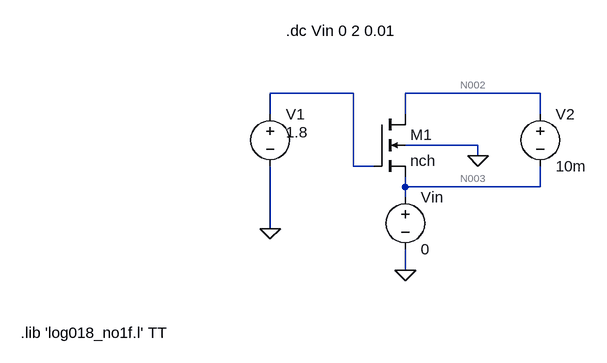
[diagram p0: schematic mosSW.asc]
mosSW.asc, the LTspice schematic file:
Version 4
SHEET 1 880 680
WIRE 96 32 -32 32
WIRE 384 32 176 32
WIRE -32 64 -32 32
WIRE 176 64 176 32
WIRE 384 64 384 32
WIRE 288 112 176 112
WIRE 288 128 288 112
WIRE 96 144 96 32
WIRE 128 144 96 144
WIRE 176 176 176 160
WIRE 384 176 384 144
WIRE 384 176 176 176
WIRE 176 192 176 176
WIRE -32 240 -32 144
WIRE 176 304 176 272
FLAG -32 240 0
FLAG 176 304 0
FLAG 288 128 0
SYMBOL voltage -32 48 R0
WINDOW 3 24 44 Left 2
WINDOW 123 0 0 Left 0
WINDOW 39 0 0 Left 0
SYMATTR Value 1.8
SYMATTR InstName V1
SYMBOL voltage 384 48 R0
SYMATTR InstName V2
SYMATTR Value 10m
SYMBOL voltage 176 176 R0
SYMATTR InstName Vin
SYMATTR Value 0
SYMBOL nmos4 128 64 R0
SYMATTR InstName M1
SYMATTR Value nch
SYMATTR Value2 l=180n w=1u m=1
TEXT -8 -64 Left 2 !.dc Vin 0 2 0.01
TEXT -416 400 Left 2 !.lib 'log018_no1f.l' TT

The netlist it stands for:
* mosSW.asc
V1 N001 0 1.8
V2 N002 N003 10m
Vin N003 0 0
M1 N002 N001 N003 0 nch l=180n w=1u m=1
.model NMOS NMOS
.model PMOS PMOS
.lib standard.mos
.dc Vin 0 2 0.01
.lib 'log018_no1f.l' TT
.backanno
.end

* Results of the author's LTspice run, read from the files saved beside the schematic
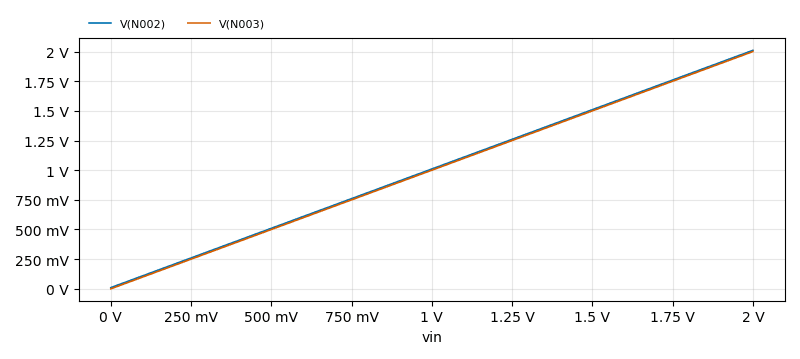
[diagram p1: DC transfer characteristic of mosSW.asc, plotted from the saved traces]
* DC transfer characteristic, 1 run:
*   V(N002): 10 mV at vin=0 V, 2.01 V at vin=2 V, min 10 mV, max 2.01 V
*   V(N003): 0 V at vin=0 V, 2 V at vin=2 V, min 0 V, max 2 V